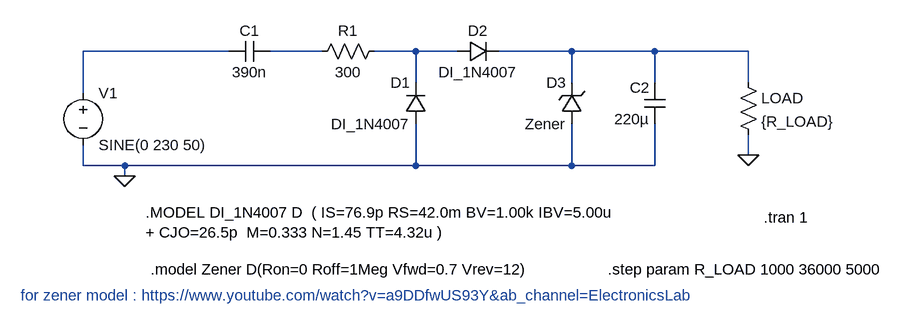
[diagram p0: schematic WithoutTransformer1.asc]
WithoutTransformer1.asc, the LTspice schematic file:
Version 4
SHEET 1 1760 680
WIRE 256 96 32 96
WIRE 400 96 320 96
WIRE 544 96 480 96
WIRE 608 96 544 96
WIRE 784 96 672 96
WIRE 912 96 784 96
WIRE 1056 96 912 96
WIRE 544 144 544 96
WIRE 784 144 784 96
WIRE 912 144 912 96
WIRE 1056 144 1056 96
WIRE 32 160 32 96
WIRE 1056 256 1056 224
WIRE 32 272 32 240
WIRE 96 272 32 272
WIRE 544 272 544 208
WIRE 544 272 96 272
WIRE 784 272 784 208
WIRE 784 272 544 272
WIRE 912 272 912 208
WIRE 912 272 784 272
WIRE 96 288 96 272
FLAG 96 288 0
FLAG 1056 256 0
SYMBOL voltage 32 144 R0
WINDOW 123 0 0 Left 0
WINDOW 39 0 0 Left 0
SYMATTR InstName V1
SYMATTR Value SINE(0 230 50)
SYMBOL cap 320 80 R90
WINDOW 0 0 32 VBottom 2
WINDOW 3 32 32 VTop 2
SYMATTR InstName C1
SYMATTR Value 390n
SYMBOL cap 928 208 R180
WINDOW 0 24 56 Left 2
WINDOW 3 24 8 Left 2
SYMATTR InstName C2
SYMATTR Value 220µ
SYMBOL res 496 80 R90
WINDOW 0 0 56 VBottom 2
WINDOW 3 32 56 VTop 2
SYMATTR InstName R1
SYMATTR Value 300
SYMBOL diode 560 208 R180
WINDOW 0 24 64 Left 2
WINDOW 3 24 0 Left 2
SYMATTR InstName D1
SYMATTR Value DI_1N4007
SYMBOL diode 608 112 R270
WINDOW 0 32 32 VTop 2
WINDOW 3 0 32 VBottom 2
SYMATTR InstName D2
SYMATTR Value DI_1N4007
SYMBOL zener 800 208 R180
WINDOW 0 24 64 Left 2
WINDOW 3 24 0 Left 2
SYMATTR InstName D3
SYMATTR Value Zener
SYMBOL res 1040 128 R0
SYMATTR InstName LOAD
SYMATTR Value {R_LOAD}
TEXT 128 344 Left 2 !.MODEL DI_1N4007 D  ( IS=76.9p RS=42.0m BV=1.00k IBV=5.00u\n+ CJO=26.5p  M=0.333 N=1.45 TT=4.32u )
TEXT 136 432 Left 2 !.model Zener D(Ron=0 Roff=1Meg Vfwd=0.7 Vrev=12)
TEXT 1080 352 Left 2 !.tran 1
TEXT -64 472 Left 2 ;for zener model : https://www.youtube.com/watch?v=a9DDfwUS93Y&ab_channel=ElectronicsLab
TEXT 840 432 Left 2 !.step param R_LOAD 1000 36000 5000

The netlist it stands for:
* WithoutTransformer1.asc
V1 N001 0 SINE(0 230 50)
C1 N002 N001 390n
C2 0 N004 220µ
R1 N003 N002 300
D1 0 N003 DI_1N4007
D2 N003 N004 DI_1N4007
D3 0 N004 Zener
R§LOAD N004 0 {R_LOAD}
.model D D
.lib standard.dio
.MODEL DI_1N4007 D  ( IS=76.9p RS=42.0m BV=1.00k IBV=5.00u
+ CJO=26.5p  M=0.333 N=1.45 TT=4.32u )
.model Zener D(Ron=0 Roff=1Meg Vfwd=0.7 Vrev=12)
.tran 1
* for zener model : https://www.youtube.com/watch?v=a9DDfwUS93Y&ab_channel=ElectronicsLab
.step param R_LOAD 1000 36000 5000
.backanno
.end